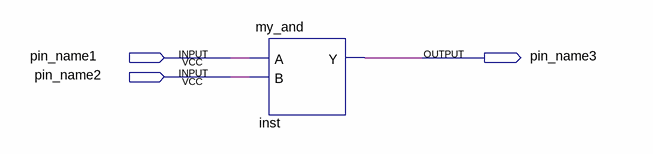
[diagram p0: schematic sheet]
// Quartus schematic test_1.bdf as structural Verilog: 1 symbols, 3 pins
module test_1 (
  input  pin_name1,
  input  pin_name2,
  output pin_name3
);

  my_and inst (.A(pin_name1), .B(pin_name2), .Y(pin_name3));
endmodule
